# EAGLE design TRS_Jack_Breakout (EAGLE 6.5.0)
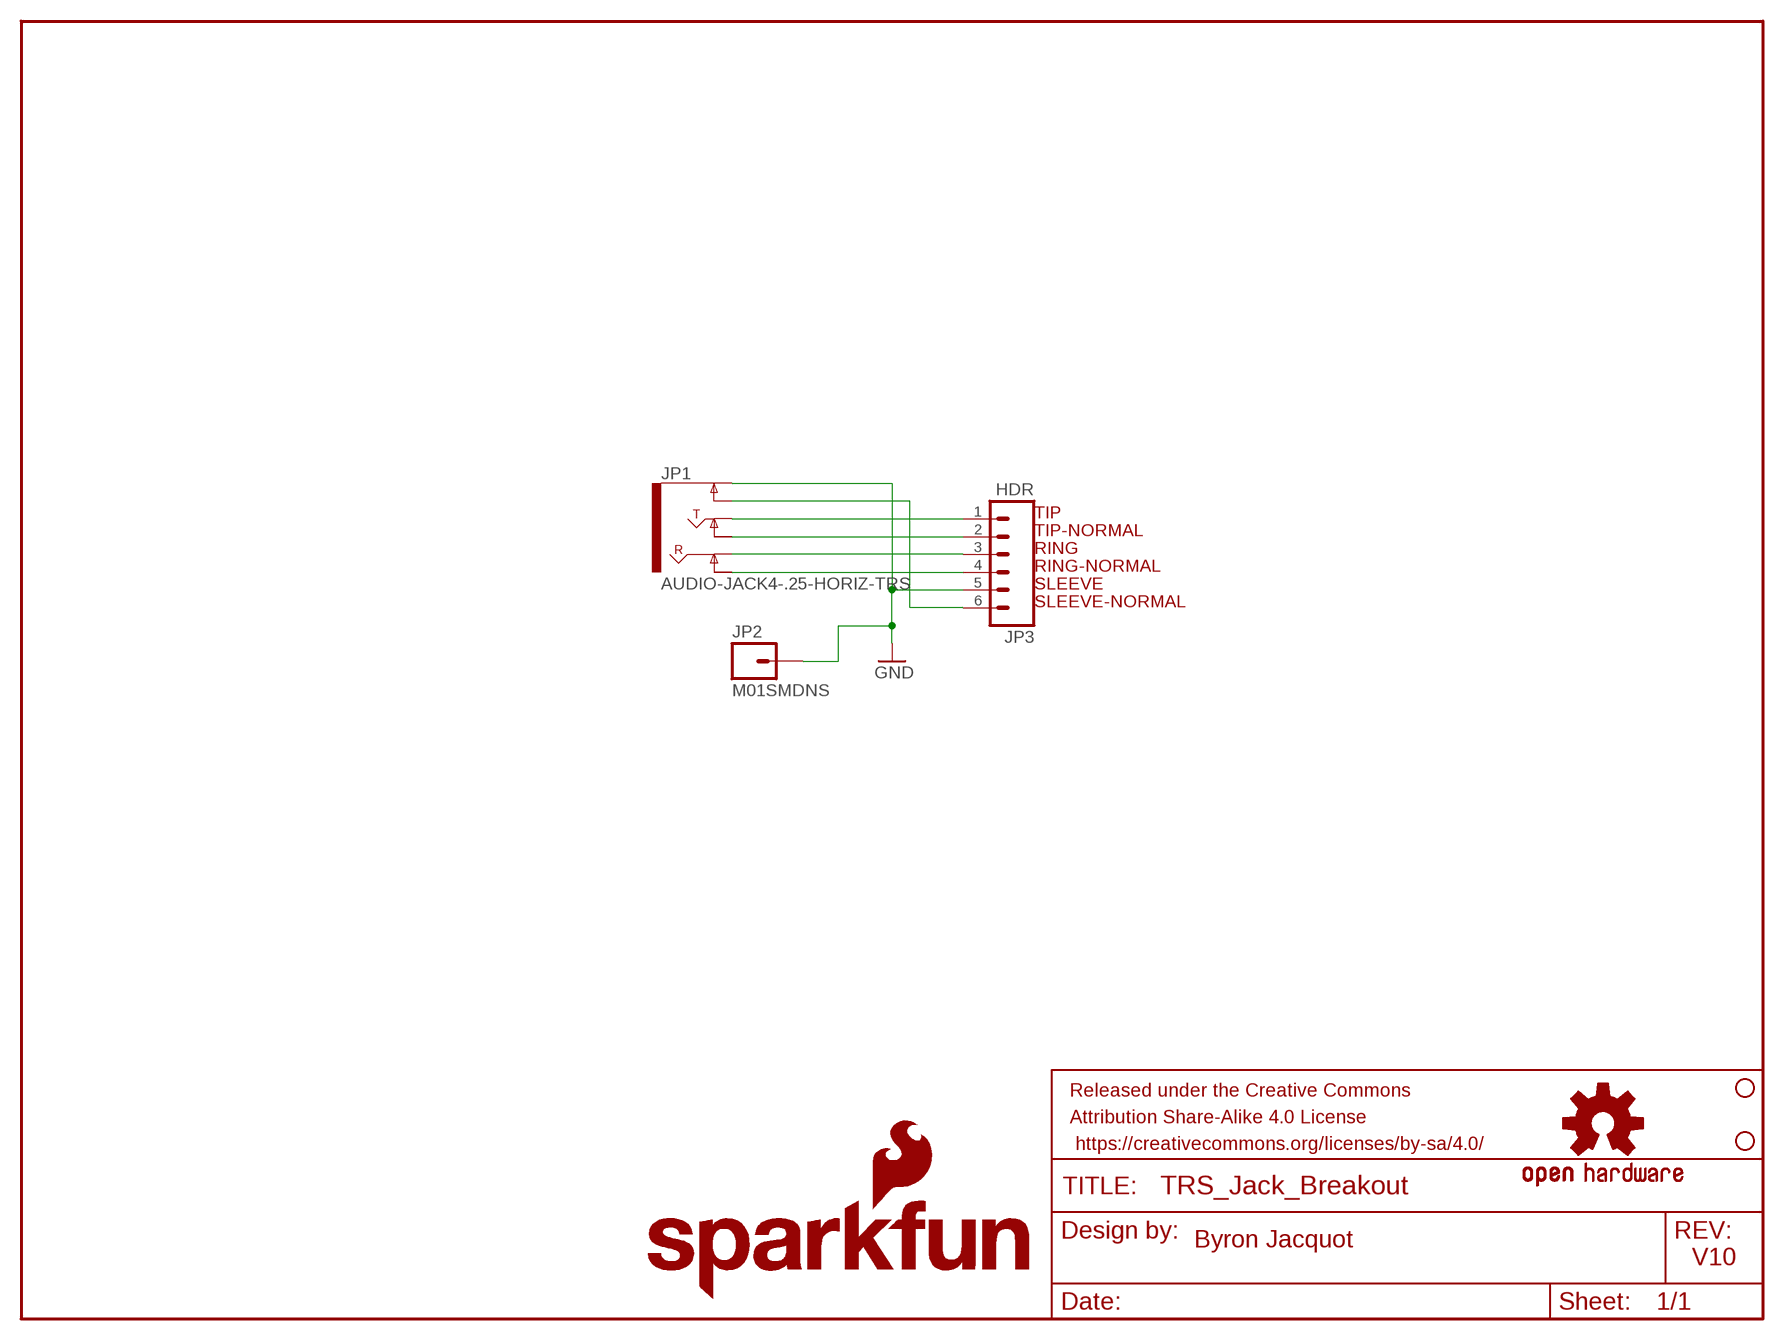
[diagram p0: schematic, sheet 1]

## Parts
FRAME1  FRAME-LETTER  [CREATIVE_COMMONS]
JP1  AUDIO-JACK4-.25-HORIZ-TRS  [AUDIO-JACK-.25-INCH-HORIZ-PTH]
JP2  M01SMDNS  [1X01NS]
JP3  HDR  M06NO_SILK  [1X06_NO_SILK]
LOGO1  SFE_LOGO_NAME_FLAME.1_INCH  [SFE_LOGO_NAME_FLAME_.1]
LOGO2  OSHW-LOGOS  [OSHW-LOGO-S]
STANDOFF1  STAND-OFF  [STAND-OFF]
STANDOFF2  STAND-OFF  [STAND-OFF]

## Nets
GND: JP1.SLEEVE(EARTH) JP2.1 JP3.5
N$1: JP1.TIP JP3.1
N$2: JP1.TIP-NORM JP3.2
N$3: JP1.RING JP3.3
N$4: JP1.RING-NORM JP3.4
N$6: JP1.SLEEVE-NORM(EARTH-NORM) JP3.6

## Notes on the sheet
- TIP
- TIP-NORMAL
- RING
- RING-NORMAL
- SLEEVE
- SLEEVE-NORMAL
- Byron Jacquot
- V10

## Library data of the parts
FRAME1 = SparkFun-Aesthetics:FRAME-LETTER: Schematic Frame Standard 8.5x11 US Letter frame
JP1 = SparkFun-Connectors:AUDIO-JACK4-.25-HORIZ-TRS: 1/4" TRS jack, horizontal Production SKU: COM-11144 Footprint unproven - datasheet and part seem to be slightly different; PROD_ID: COM-11144
JP2 = SparkFun-Connectors:M01: Header 1 Standard 1-pin 0.1" header. Use with straight break away headers (SKU : PRT-00116), right angle break away headers (PRT-00553), swiss pins (PRT-00743), machine pins (PRT-00117), and female headers (PRT-00115).
JP3 = SparkFun-Connectors:M06: Header 6 Standard 6-pin 0.1" header. Use with straight break away headers (SKU : PRT-00116), right angle break away headers (PRT-00553), swiss pins (PRT-00743), machine pins (PRT-00117), and female headers (PRT-00115). Molex polarized connector foot print use with SKU : PRT-08094 with associated crimp pins and housings. NOTES ON THE VARIANTS LOCK and LOCK_LONGPADS... This footprint was designed to help hold the alignment of a through-hole component (i.e. 6-pin header) while soldering it into place. You may notice that each hole has been shifted either up or down by 0.005 of an inch from it's more standard position (which is a perfectly straight line). This slight alteration caused the pins (the squares in the middle) to touch the edges of the holes. Because they are alternating, it causes a "brace" to hold the component in place. 0.005 has proven to be the perfect amount of "off-center" position when using our standard breakaway headers. Although looks a little odd when you look at the bare footprint, once you have a header in there, the alteration is very hard to notice. Also,if you push a header all the way into place, it is covered up entirely on the bottom side. This idea of altering the position of holes to aid alignment will be further integrated into the Sparkfun Library for other footprints. It can help hold any component with 3 or more connection pins.
LOGO1 = SparkFun-Aesthetics:SFE_LOGO_NAME_FLAME: SFE Logo, name and flame This is the SparkFun full logo. The logo on the schematic will always be the same size; the package variant is the height of the flame part of the logo. Default layer for the logo on the board is tSilk.
LOGO2 = SparkFun-Aesthetics:OSHW-LOGO: Open Source Hardware Logo This logo indicates the piece of hardware it is found on incorporates a OSHW license and/or adheres to the definition of open source hardware found here: http://freedomdefined.org/OSHW
STANDOFF1 STANDOFF2 = SparkFun-Electromechanical:STAND-OFF: #4 Stand Off This is the mechanical footprint for a #4 phillips button head screw. Use the keepout ring to avoid running the screw head into surrounding components. SKU : PRT-00447

## Board
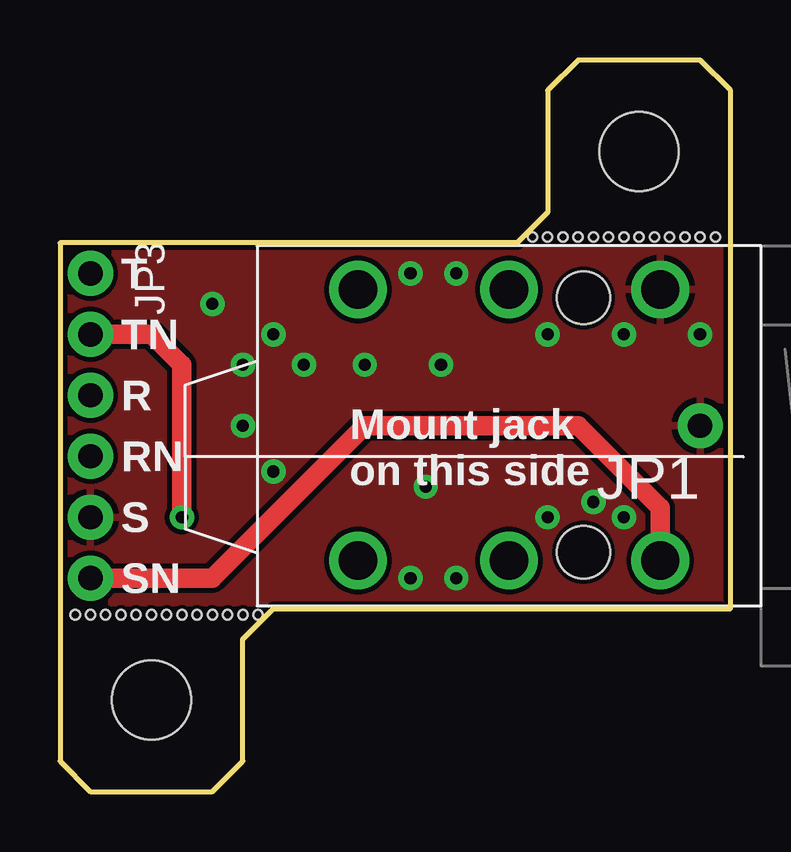
[diagram p1: board, top side]
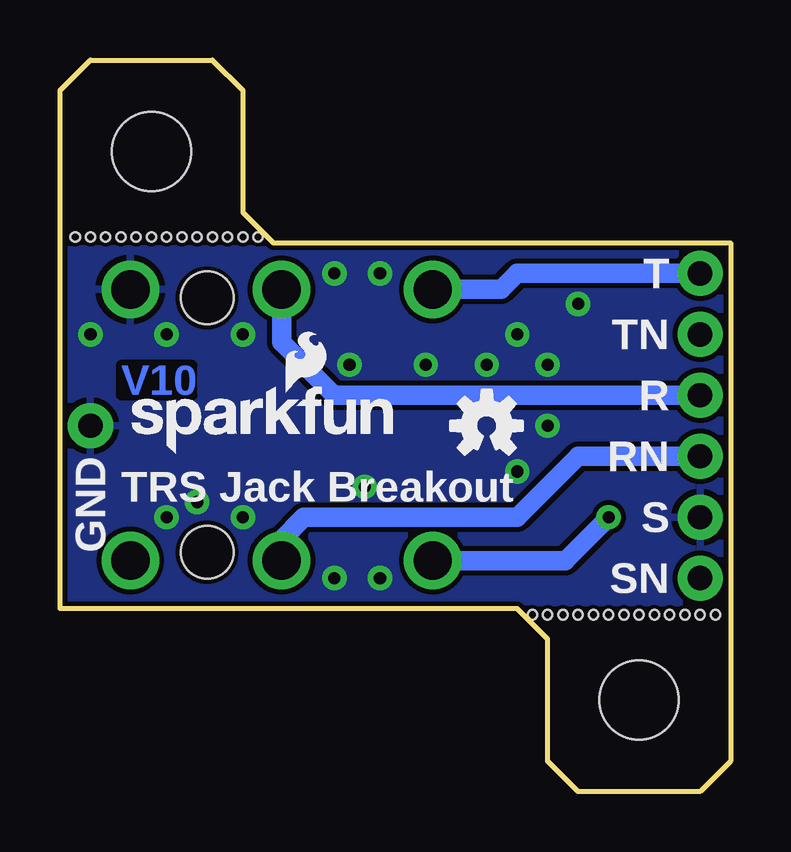
[diagram p2: board, bottom side, seen from below]

Size 27.94 x 30.48 mm. Coordinates in mm from the lower left corner, seen from the top.
Outline: 27.94,29.21 26.67,30.48 21.59,30.48 20.32,29.21 20.32,24.13 19.05,22.86 0,22.86 0,1.27 1.27,0 6.35,0 7.62,1.27 7.62,6.35 8.89,7.62 27.94,7.62 27.94,29.21
Copper layers (1*16): Top 0.035mm / dielectric 1.5mm / Bottom 0.035mm
Design rules "SparkFun-2-layer": minimum track width 7mil, minimum drill 15mil, track to track 8mil, track to pad 8mil, pad to pad 8mil, via to via 8mil, smd to smd 8mil, copper to edge 8mil, drill to drill 8mil, minimum pad ring 12mil, minimum via ring 10mil, stop-mask expansion 4mil, vias tented up to drill 20mil, thermal gap 10mil
Holes 0.38 mm at 1.91,7.37 0.64,7.37 3.17,7.37 4.45,7.37 6.99,7.37 5.71,7.37 8.26,7.37 1.27,7.37 2.54,7.37 3.81,7.37 5.08,7.37 6.35,7.37 7.62,7.37 20.95,23.11 19.68,23.11 22.23,23.11 23.5,23.11 26.04,23.11 24.77,23.11 27.3,23.11 20.32,23.11 21.59,23.11 22.86,23.11 24.13,23.11 25.4,23.11 26.67,23.11

### Footprints (pad centres in the part's own frame; a part is rotated, then mirrored left to right if it is on the bottom)
AUDIO-JACK-.25-INCH-HORIZ-PTH = drill 1.6: RING 10.5,-6.95; RING-NORM 10.5,4.35; SLEEVE 4.2,-6.95; SLEEVE-NORM 4.2,4.35; TIP 16.8,-6.95; TIP-NORM 16.8,4.35 | hole 2.2: 7.4,4; 7.4,-6.6
1X01NS = drill 1.016 pad 1.88: 1 0,0
1X06_NO_SILK = drill 1.016 pad 1.88: 1 0,0; 2 2.54,0; 3 5.08,0; 4 7.62,0; 5 10.16,0; 6 12.7,0
STAND-OFF = hole 3.302: 0,0

### Placement (x,y rotation side)
FRAME1  7.62,-12.7 0 top  (outside the outline)
JP1  29.21,13.97 180 top
JP2  26.67,15.24 0 top
JP3  1.27,21.59 270 top
LOGO1  25.4,13.97 0 bottom
LOGO2  10.16,15.24 0 bottom
STANDOFF1  24.13,26.67 0 top
STANDOFF2  3.81,3.81 0 top

### Tracks (layer width: path | path; a pad name or v marks a point on that pad's centre or on a via)
GND  (via drill 0.51)
  other vias: 16.51,21.59 15.88,17.78 12.7,17.78 10.16,17.78 7.62,17.78 6.35,20.32 8.89,19.05 14.61,21.59 20.32,11.43 16.51,8.89 14.61,8.89 15.24,12.7 22.23,12.06 23.5,11.43 8.89,13.34 7.62,15.24 26.67,19.05 23.5,19.05 20.32,19.05
  pour Top: 0,22.86 0,7.62 27.94,7.62 27.94,22.86
  pour Bottom: 0,22.86 27.94,22.86 27.94,7.62 0,7.62
N$1
  Bottom 0.813: JP1.TIP 9.56,20.92 8.89,21.59 JP3.1
N$2  (via drill 0.51)
  Top 0.813: v5.08,11.43 5.08,17.78 3.81,19.05 JP3.2
  Bottom 0.813: JP1.TIP-NORM 6.89,9.62 v5.08,11.43
N$3
  Bottom 0.813: JP1.RING 18.71,18.71 16.51,16.51 JP3.3
N$4
  Bottom 0.813: JP3.4 6.35,13.97 8.89,11.43 17.78,11.43 18.71,10.5 JP1.RING-NORM
N$6
  Top 0.813: JP3.6 6.35,8.89 12.7,15.24 21.59,15.24 25.01,11.82 JP1.SLEEVE-NORM

### Text on the board
Bottom: V10
tPlace: T | TN | R | RN | Mount jack / on this side | S | SN
bPlace: T | TN | R | RN | GND | TRS Jack Breakout | S | SN
tDocu: Byron Jacquot